# EAGLE design 203_color (EAGLE 9.6.2)
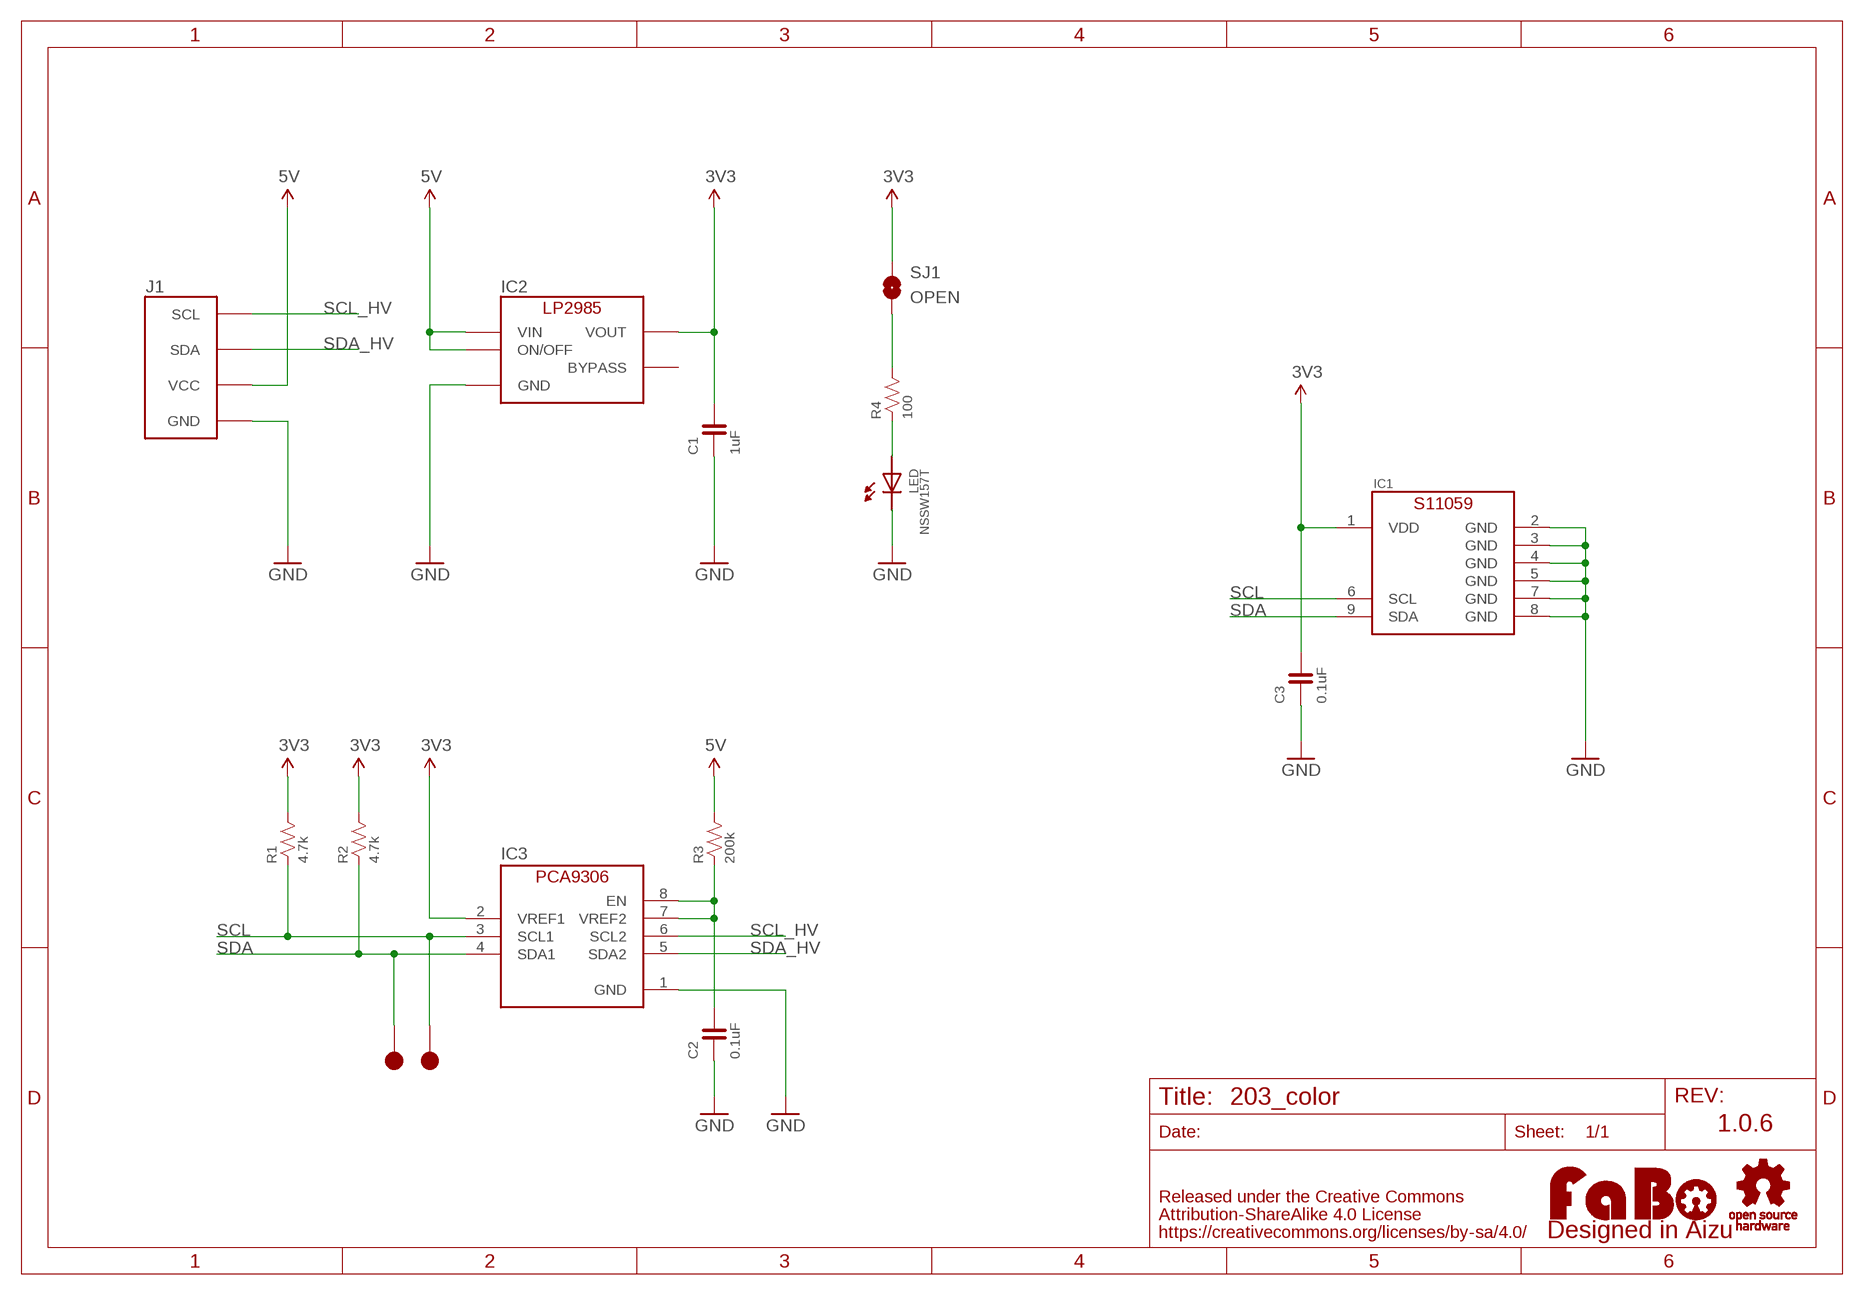
[diagram p0: schematic, sheet 1]

## Parts
C1  1uF  CAPACITOR-0603  [0603]
C2  0.1uF  CAPACITOR-0603  [0603]
C3  0.1uF  CAPACITOR-0603  [0603]
IC1  HAMAMATSU-S11059  [HAMAMATSU-S11059]
IC2  LP2985-33DBV  [SOT-23-5]
IC3  PCA9306GM  [XQFN8]
J1  FABO_BRICK_I2C  [FABO_BRICK_I2C]
LED  NSSW157T  [NSSW157T]
LOGO1  LOGO_FABO-M  [LOGO_FABO_M]
R1  4.7k  RESISTOR-0603  [0603]
R2  4.7k  RESISTOR-0603  [0603]
R3  200k  RESISTOR-0603  [0603]
R4  100  RESISTOR-0603  [0603]
SJ1  OPEN  SMD-JUMPER-2-OPEN  [SMD-JUMPER-2-OPEN]
TP1  TP-15  [TP-15]
TP2  TP-15  [TP-15]
U$2  LOGO_OSHW-M_BOTTOM  [LOGO_OSHW_M_BOTTOM]

## Nets
3V3: C1.2 C3.2 IC1.1(VDD) IC2.5(VOUT) IC3.2(VREF1) R1.2 R2.2 SJ1.1
5V: IC2.1(VIN) IC2.3(ON/OFF) J1.VCC R3.2
GND: C1.1 C2.1 C3.1 IC1.2(GND) IC1.3(GND) IC1.4(GND) IC1.5(GND) IC1.7(GND) IC1.8(GND) IC2.2(GND) IC3.1(GND) J1.GND LED.CATHODE1(CATHODE) LED.CATHODE2(CATHODE)
N$1: LED.ANODE1(ANODE) LED.ANODE2(ANODE) R4.1
N$2: C2.2 IC3.7(VREF2) IC3.8(EN) R3.1
N$3: R4.2 SJ1.2
SCL: IC1.6(SCL) IC3.3(SCL1) R1.1 TP2.1
SCL_HV: IC3.6(SCL2) J1.SCL
SDA: IC1.9(SDA) IC3.4(SDA1) R2.1 TP1.1
SDA_HV: IC3.5(SDA2) J1.SDA
Unconnected: IC2.4(BYPASS)

## Notes on the sheet
- 1.0.6

## Library data of the parts
C1-C3 = FaBo-Capacitor:CAPACITOR: CAPACITOR
IC1 = FaBo-Sensor:HAMAMATSU-S11059
IC2 = FaBo-Supply:LP2985: LP2985
IC3 = FaBo-LevelTranslator:PCA9306
J1 = FaBo-Template:FABO_BRICK_I2C: FaBo Brick I2C
LED = FaBo-LED:NSSW157T
LOGO1 = component:LOGO_FABO
R1-R4 = FaBo-Resistors:RESISTOR: RESISTOR
SJ1 = FaBo-Supply:SMD-JUMPER-2
TP1 TP2 = FaBo-Supply:TP
U$2 = FaBo-etc:LOGO_OSHW

## Board
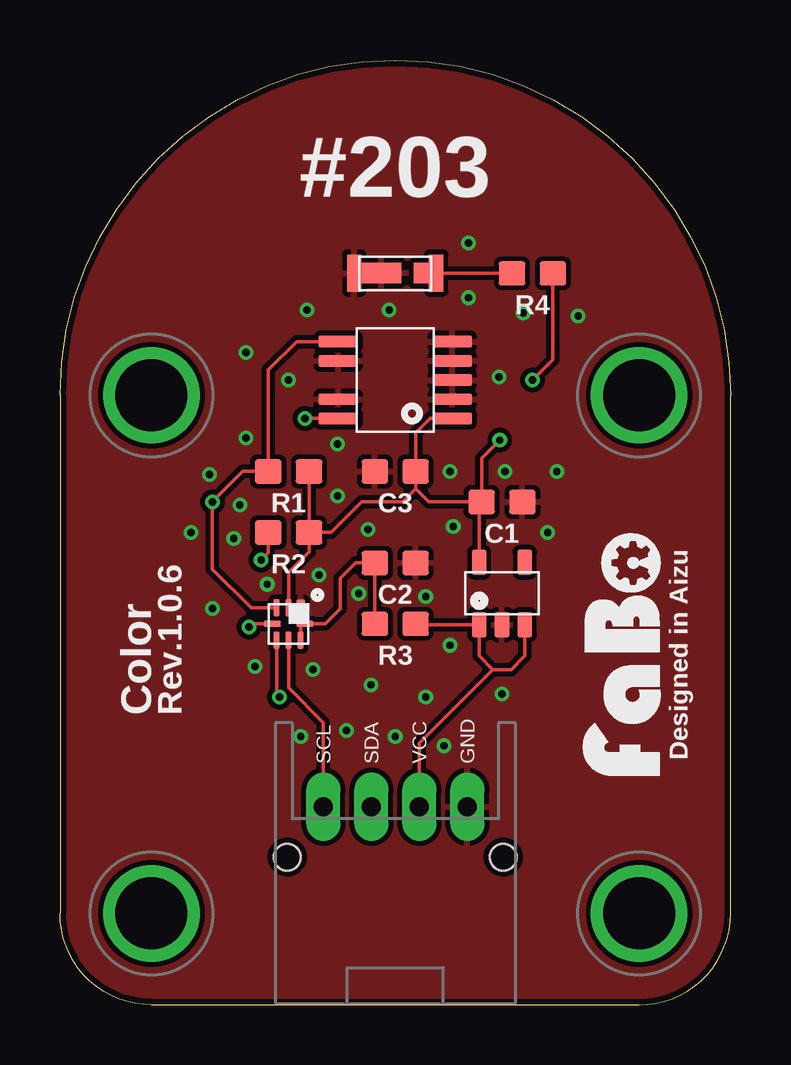
[diagram p1: board, top side]
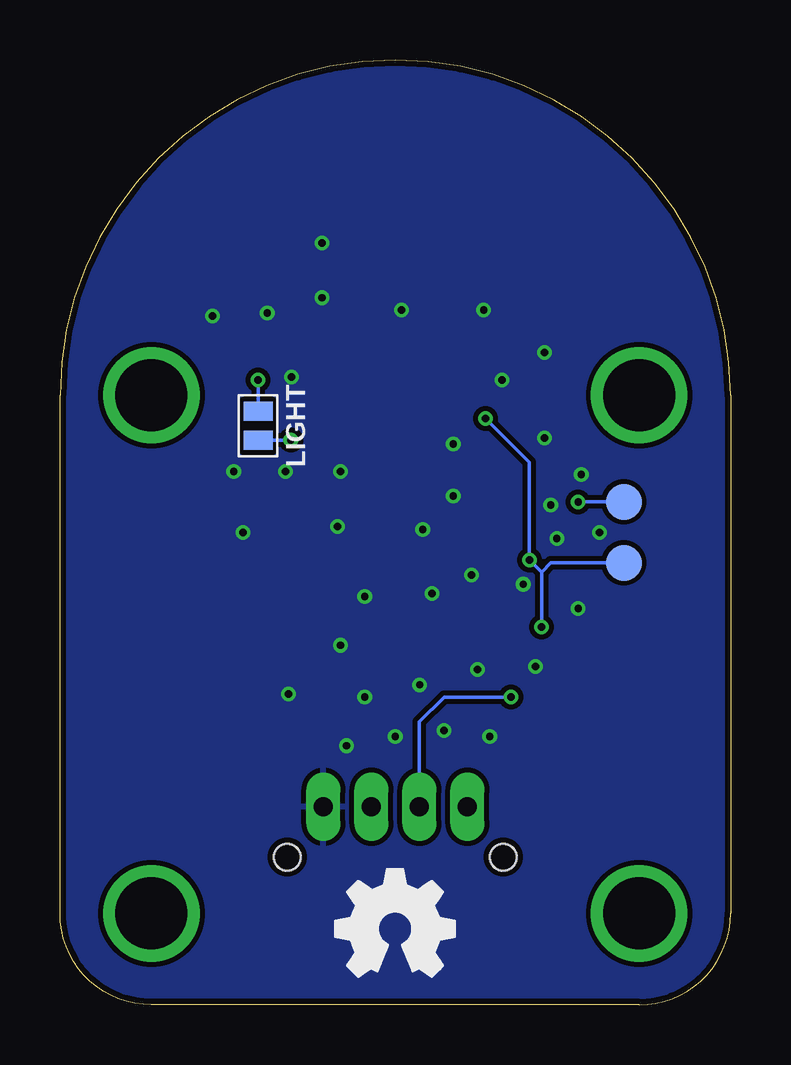
[diagram p2: board, bottom side, seen from below]

Size 27.94 x 39.37 mm. Coordinates in mm from the lower left corner, seen from the top.
Copper layers (1*16): Top 0.035mm / dielectric 1.6mm / Bottom 0.035mm
Design rules "PCBway": minimum track width 6mil, minimum drill 12mil, track to track 6mil, track to pad 6mil, pad to pad 6mil, via to via 6mil, smd to smd 6mil, copper to edge 10mil, drill to drill 10mil, minimum pad ring 10mil, minimum via ring 6mil, stop-mask expansion 2mil, vias tented up to drill 100mil, thermal gap 8mil

### Footprints (pad centres in the part's own frame; a part is rotated, then mirrored left to right if it is on the bottom)
0603 = smd 1.1 x 1: 1 -0.85,0; 2 0.85,0
HAMAMATSU-S11059 = smd 1.65 x 0.5: 1 -2.375,1.6; 2 -2.375,0.8; 3 -2.375,0; 4 -2.375,-0.8; 5 -2.375,-1.6; 6 2.375,-1.6; 7 2.375,-0.8; 8 2.375,0.8; 9 2.375,1.6
SOT-23-5 = smd 0.6 x 1.05: 1 -0.95,-1.3; 2 0,-1.3; 3 0.95,-1.3; 4 0.95,1.3; 5 -0.95,1.3
XQFN8 = smd 0.7 x 0.35: 1 -0.675,0.5 | smd 0.7 x 0.25: 2 -0.675,0; 3 -0.675,-0.5; 5 0.675,-0.5; 6 0.675,0; 7 0.675,0.5 | smd 0.25 x 0.7: 4 0,-0.675; 8 0,0.675
FABO_BRICK_I2C = drill 0.8 pad 1.422 long: GND 3,-10.795; SCL -3,-10.795; SDA -1,-10.795; VCC 1,-10.795 | drill 3 pad 3.81: P$1 -10.16,6.35; P$2 10.16,6.35; P$3 -10.16,-15.24; P$4 10.16,-15.24 | hole 1.1: -4.5,-12.895; 4.5,-12.895
NSSW157T = smd 0.6 x 1.55: ANODE1 1.7,0.01; CATHODE2 -1.71,0.01 | smd 0.64 x 0.86: ANODE2 1.08,0.01 | smd 1.66 x 0.86: CATHODE1 -0.59,0.02
SMD-JUMPER-2-OPEN = smd 0.8 x 1.2: 1 -0.6,0; 2 0.6,0
TP-15 = smd 1.5 x 1.5: 1 0,0

### Placement (x,y rotation side)
C1  18.41,20.95 180 top
C2  13.97,18.41 180 top
C3  13.97,22.23 0 top
IC1  13.97,26.04 180 top
IC2  18.41,17.14 0 top
IC3  9.53,15.88 270 top
J1  13.97,19.05 0 top
LED  13.97,30.48 0 top
LOGO1  25.4,14.61 90 top
R1  9.53,22.23 0 top
R2  9.53,19.68 0 top
R3  13.97,15.88 0 top
R4  19.68,30.48 0 top
SJ1  19.68,24.13 90 bottom
TP1  4.45,18.41 0 bottom
TP2  4.45,20.95 0 bottom
U$2  13.97,3.17 0 top

### Tracks (layer width: path | path; a pad name or v marks a point on that pad's centre or on a via)
3V3  (via drill 0.3)
  Top 0.152: R2.2 R1.2 | IC2.5 17.46,20.86 C1.2 | C1.2 17.57,22.77 v18.32,23.53 | R2.2 11.3,19.68 12.57,20.95 14.27,20.95 14.82,21.5 | 14.82,21.5 C3.2 14.82,23.84 15.42,24.43 IC1.1 | 14.82,21.5 15.37,20.95 C1.2 | IC3.2 9.53,18.03 10.38,18.88 R2.2
  Bottom 0.152: SJ1.1 v18.32,23.53
5V
  Top 0.152: 18.03,13.97 17.46,14.54 IC2.1 14.85,15.85 R3.2 | IC2.3 19.36,14.54 18.8,13.97 18.03,13.97 | J1.VCC 14.97,10.91 18.03,13.97
GND  (via drill 0.3)
  other vias: 8.64,17.53 10.79,17.91 12.45,17.14 15.24,17.02 16.38,19.94 12.83,19.81 11.56,21.21 7.49,20.83 6.35,16.51 8.13,14.1 10.54,13.97 16.26,14.99 18.41,12.95 20.32,19.68 16.26,22.23 11.56,23.37 20.7,22.23 10.03,11.18 11.94,11.43 13.97,11.18 16,10.79 15.24,12.83 12.95,13.34 7.75,23.62 9.53,26.04 7.75,27.18 21.59,28.7 19.3,28.83 13.72,28.96 10.29,28.96 17.02,31.75 17.02,29.46 18.54,22.23 18.29,26.16 6.22,22.1 7.24,19.43 5.46,19.68
  pour Bottom (isolate 0.203): 0,0 27.94,0 27.94,39.37 0,39.37
  pour Top (isolate 0.203): 0,0 27.94,0 27.94,39.37 0,39.37
N$1
  Top 0.152: R4.1 LED.ANODE1 LED.ANODE2
N$2
  Top 0.152: IC3.7 10.03,15.88 IC3.8 11.05,15.88 11.68,16.51 11.68,17.78 12.32,18.41 C2.2 R3.1
N$3  (via drill 0.3)
  Top 0.152: v19.68,26.04 20.54,26.89 R4.2
  Bottom 0.152: SJ1.2 v19.68,26.04
SCL  (via drill 0.3)
  Top 0.152: IC1.6 9.86,27.64 8.68,26.45 R1.1 7.62,22.23 v6.35,20.95 6.35,18.16 7.96,16.55 IC3.3
  Bottom 0.152: TP2.1 v6.35,20.95
SCL_HV
  Top 0.152: IC3.6 9.53,13.21 10.97,11.76 J1.SCL
SDA  (via drill 0.3)
  Top 0.152: R2.1 8.68,18.84 v8.38,18.54 | IC3.4 8,15.88 v7.87,15.75 | IC1.9 v10.21,24.43
  Bottom 0.152: v7.87,15.75 7.87,18.03 | 7.87,18.03 v8.38,18.54 8.38,22.61 v10.21,24.43 | TP1.1 7.49,18.41 7.87,18.03
SDA_HV  (via drill 0.3)
  Top 0.152: IC3.5 9.03,12.95 v9.14,12.83
  Bottom 0.152: v9.14,12.83 11.94,12.83 12.97,11.79 J1.SDA

### Text on the board
tPlace: #203 | Designed in Aizu | Color | Rev.1.0.6
bPlace: LIGHT